# EAGLE schematic 3Fazes (EAGLE 9.6.2)
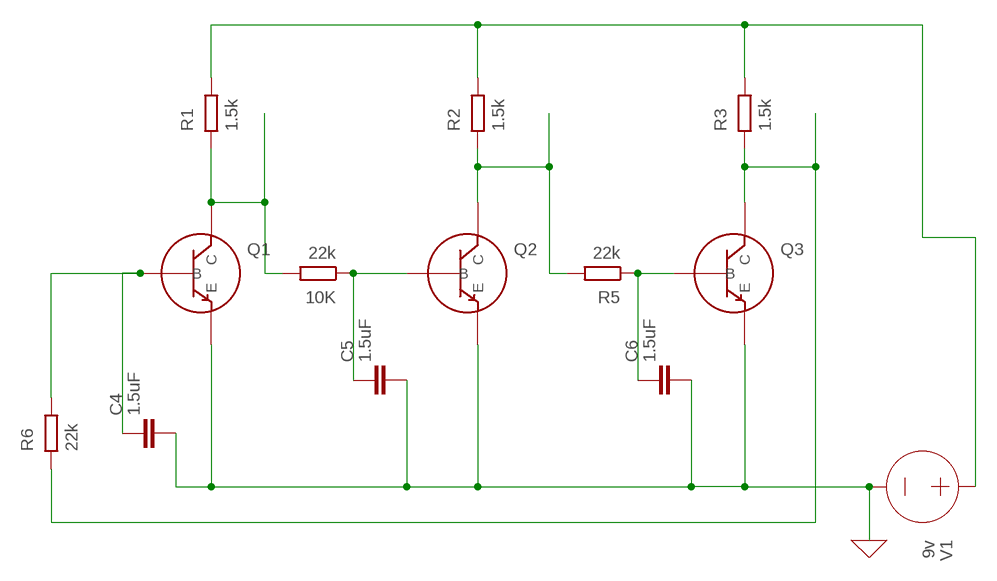
[diagram p0: schematic, sheet 1]

## Parts
10K  22k  R  (no package)
C4  1.5uF  C  (no package)
C5  1.5uF  C  (no package)
C6  1.5uF  C  (no package)
Q1  BJT_NPN  (no package)
Q2  BJT_NPN  (no package)
Q3  BJT_NPN  (no package)
R1  1.5k  R  (no package)
R2  1.5k  R  (no package)
R3  1.5k  R  (no package)
R5  22k  R  (no package)
R6  22k  R  (no package)
V1  9v  VOLTAGE  (no package)

## Nets
0: C4.2 C5.2 C6.2 Q1.E Q2.E Q3.E V1.- ; supply symbol labelled GND
N$1: 10K.2 Q1.C R1.1
N$2: C4.1 Q1.B R6.2
N$5: Q2.C R2.1 R5.2
N$7: 10K.1 C5.1 Q2.B
N$8: C6.1 Q3.B R5.1
N$9: Q3.C R3.1 R6.1
N$11: R1.2 R2.2 R3.2 V1.+

## Library data of the parts
10K R1-R3 R5 R6 = ngspice-simulation:R: RESISTOR
C4-C6 = ngspice-simulation:C: CAPACITOR
Q1-Q3 = ngspice-simulation:BJT_NPN: Bipolar NPN Transistor
V1 = ngspice-simulation:VOLTAGE: Independent Voltage Source, either DC, AC, PULSE, SINE, PWL, EXP, or SFFM; VALUE: 0V